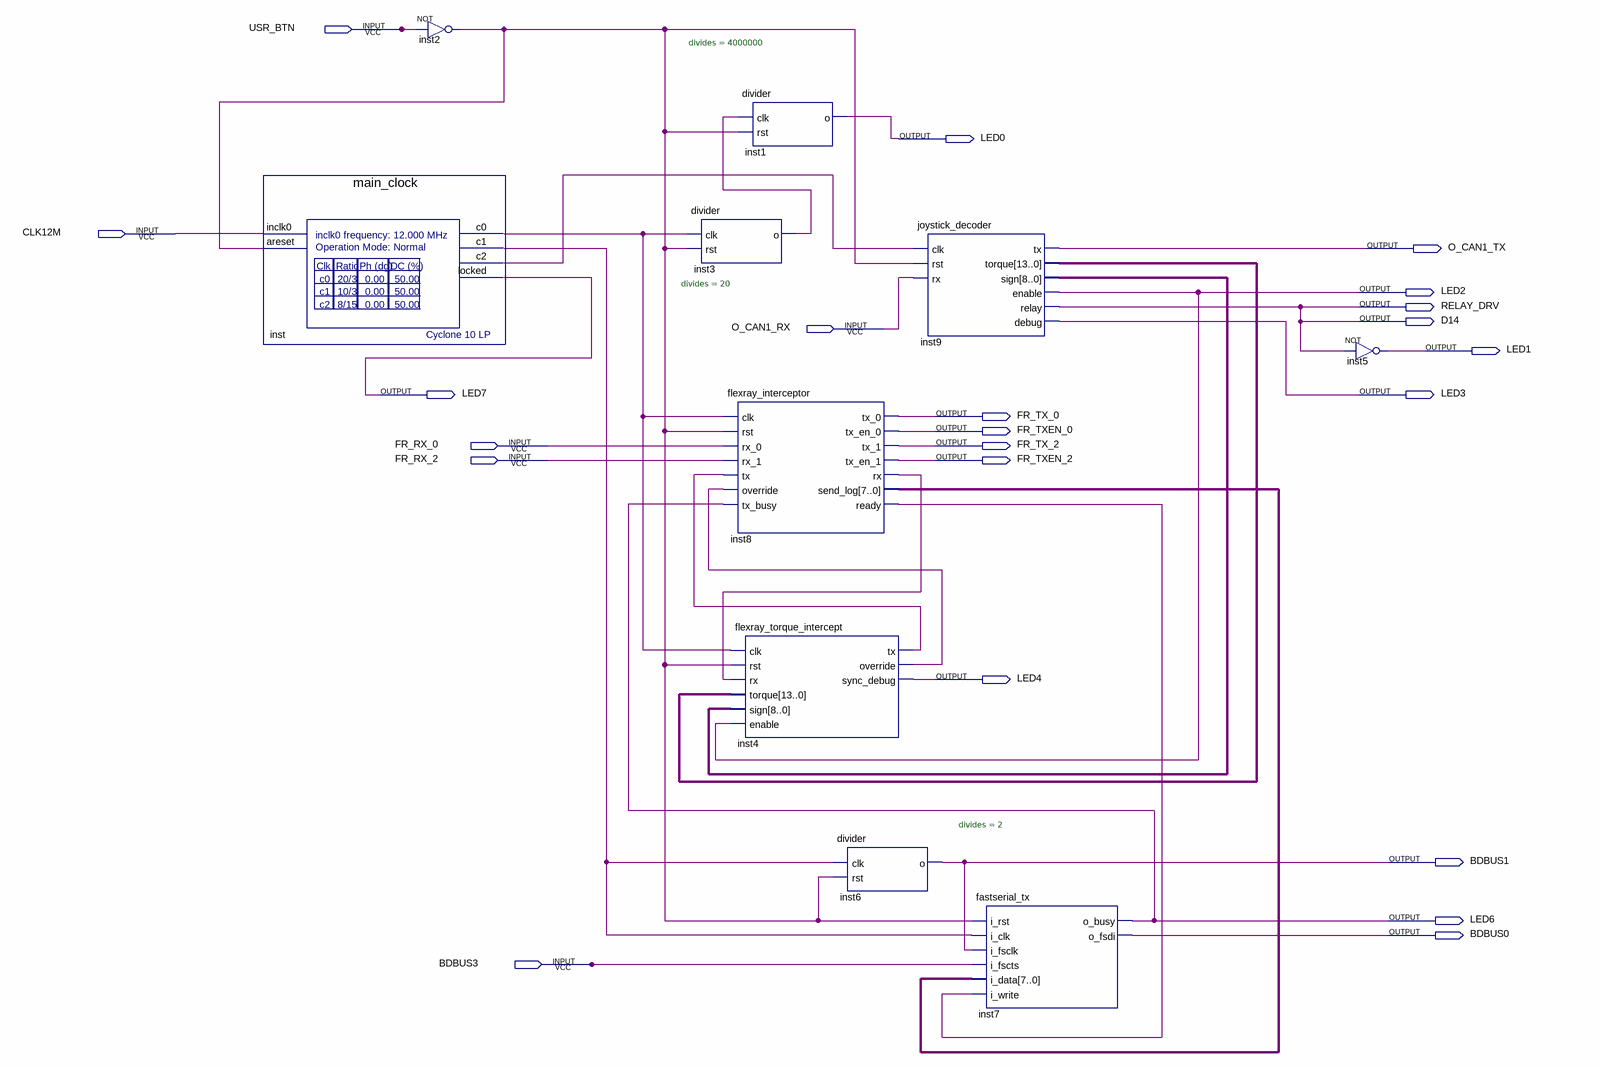
[diagram p0: schematic sheet]
// Quartus schematic bendbeam.bdf as structural Verilog: 10 symbols, 22 pins
module bendbeam (
  input  USR_BTN,
  input  CLK12M,
  input  O_CAN1_RX,
  input  FR_RX_0,
  input  FR_RX_2,
  input  BDBUS3,
  output LED0,
  output O_CAN1_TX,
  output LED2,
  output RELAY_DRV,
  output D14,
  output LED1,
  output LED7,
  output LED3,
  output FR_TX_0,
  output FR_TXEN_0,
  output FR_TX_2,
  output FR_TXEN_2,
  output LED4,
  output BDBUS1,
  output LED6,
  output BDBUS0
);

  wire inst2_out, inst3_o, inst4_override, inst4_tx, inst8_ready, inst8_rx, inst_c0, inst_c1, inst_c2;
  wire [7:0] inst8_send_log;
  wire [8:0] inst9_sign;
  wire [13:0] inst9_torque;

  main_clock inst (.inclk0(CLK12M), .areset(inst2_out), .c0(inst_c0), .c1(inst_c1), .c2(inst_c2), .locked(LED7));
  not inst2 (inst2_out, USR_BTN);
  divider #(.divides(20)) inst3 (.clk(inst_c0), .rst(inst2_out), .o(inst3_o));
  divider #(.divides(4000000)) inst1 (.clk(inst3_o), .rst(inst2_out), .o(LED0));
  flexray_interceptor inst8 (
    .clk(inst_c0), .rst(inst2_out), .rx_0(FR_RX_0), .rx_1(FR_RX_2), .tx(inst4_tx), .override(inst4_override),
    .tx_busy(LED6), .tx_0(FR_TX_0), .tx_en_0(FR_TXEN_0), .tx_1(FR_TX_2), .tx_en_1(FR_TXEN_2), .rx(inst8_rx),
    .send_log(inst8_send_log), .ready(inst8_ready));
  flexray_torque_intercept inst4 (
    .clk(inst_c0), .rst(inst2_out), .rx(inst8_rx), .sign(inst9_sign), .enable(LED2), .torque(inst9_torque),
    .tx(inst4_tx), .override(inst4_override), .sync_debug(LED4));
  divider #(.divides(2)) inst6 (.clk(inst_c1), .rst(inst2_out), .o(BDBUS1));
  joystick_decoder inst9 (
    .clk(inst_c2), .rst(inst2_out), .rx(O_CAN1_RX), .tx(O_CAN1_TX), .sign(inst9_sign), .enable(LED2),
    .relay(D14), .debug(LED3), .torque(inst9_torque));
  fastserial_tx inst7 (
    .i_rst(inst2_out), .i_clk(inst_c1), .i_fsclk(BDBUS1), .i_fscts(BDBUS3), .i_data(inst8_send_log),
    .i_write(inst8_ready), .o_busy(LED6), .o_fsdi(BDBUS0));
  not inst5 (LED1, D14);

  assign RELAY_DRV = D14;
endmodule
